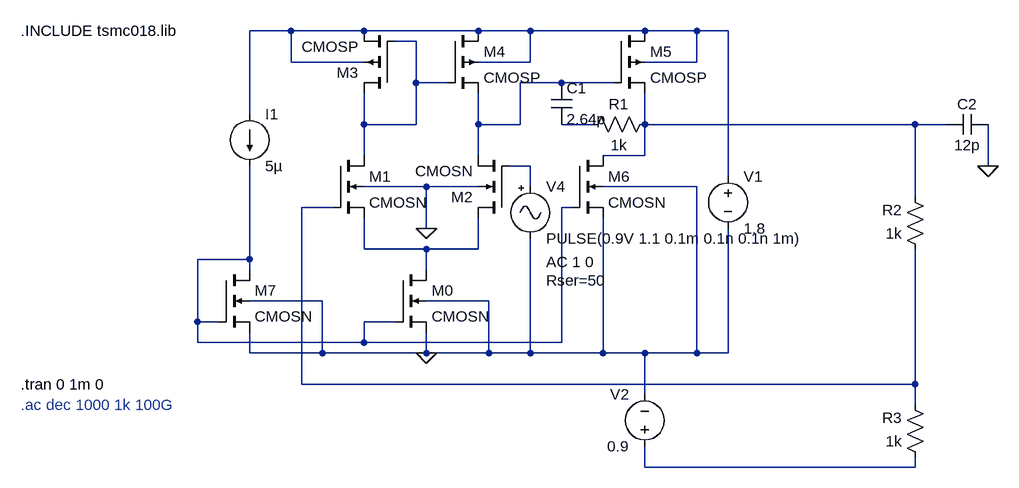
[diagram p0: schematic final_design.asc]
final_design.asc, the LTspice schematic file:
Version 4
SHEET 1 1144 708
WIRE -16 32 -80 32
WIRE 96 32 -16 32
WIRE 272 32 96 32
WIRE 352 32 272 32
WIRE 528 32 352 32
WIRE 608 32 528 32
WIRE 656 32 608 32
WIRE 176 48 144 48
WIRE -16 80 -16 32
WIRE 96 80 -16 80
WIRE 352 80 352 32
WIRE 352 80 272 80
WIRE 608 80 608 32
WIRE 608 80 528 80
WIRE 176 112 176 48
WIRE 224 112 176 112
WIRE 400 112 336 112
WIRE 480 112 400 112
WIRE -80 160 -80 32
WIRE 96 176 96 128
WIRE 176 176 176 112
WIRE 176 176 96 176
WIRE 272 176 272 128
WIRE 336 176 336 112
WIRE 336 176 272 176
WIRE 448 176 400 176
WIRE 528 176 528 128
WIRE 944 176 528 176
WIRE 992 176 944 176
WIRE 96 224 96 176
WIRE 272 224 272 176
WIRE 528 224 528 176
WIRE 528 224 464 224
WIRE 352 240 320 240
WIRE 1056 240 1056 176
WIRE 656 256 656 32
WIRE 192 272 96 272
WIRE 272 272 192 272
WIRE 352 272 352 240
WIRE 608 272 464 272
WIRE 944 288 944 176
WIRE 48 304 0 304
WIRE 416 304 400 304
WIRE 192 336 192 272
WIRE 96 368 96 320
WIRE 192 368 96 368
WIRE 272 368 272 320
WIRE 272 368 192 368
WIRE -80 384 -80 240
WIRE -80 384 -160 384
WIRE -80 400 -80 384
WIRE 192 400 192 368
WIRE 32 448 -80 448
WIRE 288 448 192 448
WIRE -160 480 -160 384
WIRE -128 480 -160 480
WIRE 144 480 96 480
WIRE -160 512 -160 480
WIRE 96 512 96 480
WIRE 96 512 -160 512
WIRE 400 512 400 304
WIRE 400 512 96 512
WIRE -80 528 -80 496
WIRE 32 528 32 448
WIRE 32 528 -80 528
WIRE 192 528 192 496
WIRE 192 528 32 528
WIRE 288 528 288 448
WIRE 288 528 192 528
WIRE 352 528 352 352
WIRE 352 528 288 528
WIRE 464 528 464 320
WIRE 464 528 352 528
WIRE 528 528 464 528
WIRE 608 528 608 272
WIRE 608 528 528 528
WIRE 656 528 656 336
WIRE 656 528 608 528
WIRE 0 576 0 304
WIRE 944 576 944 368
WIRE 944 576 0 576
WIRE 528 592 528 528
WIRE 944 608 944 576
WIRE 528 704 528 672
WIRE 944 704 944 688
WIRE 944 704 528 704
FLAG 192 528 0
FLAG 192 336 0
FLAG 1056 240 0
SYMBOL current -80 160 R0
WINDOW 123 0 0 Left 2
WINDOW 39 0 0 Left 2
SYMATTR InstName I1
SYMATTR Value 5µ
SYMBOL voltage 656 240 R0
WINDOW 123 0 0 Left 2
WINDOW 39 0 0 Left 2
SYMATTR InstName V1
SYMATTR Value 1.8
SYMBOL cmosp 144 128 R180
SYMATTR InstName M3
SYMATTR Value2 l=0.9um w=17.577um
SYMBOL cmosp 224 32 R0
SYMATTR InstName M4
SYMATTR Value2 l=0.9um w=17.577um
SYMBOL cmosn -128 400 R0
SYMATTR InstName M7
SYMATTR Value2 l=0.9um w=0.98um
SYMBOL cmosn 144 400 R0
SYMATTR InstName M0
SYMATTR Value2 l=0.9um w=9.78um
SYMBOL cmosn 48 224 R0
SYMATTR InstName M1
SYMATTR Value2 l=0.9um w=489.132um
SYMBOL cmosn 320 320 R180
SYMATTR InstName M2
SYMATTR Value2 l=0.9um w=489.132um
SYMBOL cmosn 416 224 R0
SYMATTR InstName M6
SYMATTR Value2 l=0.9um w=19.566um
SYMBOL Misc\\signal 352 256 R0
WINDOW 123 24 132 Left 2
WINDOW 39 24 160 Left 2
SYMATTR Value2 AC 1 0
SYMATTR SpiceLine Rser=50
SYMATTR InstName V4
SYMATTR Value PULSE(0.9V 1.1 0.1m 0.1n 0.1n 1m)
SYMBOL cmosp 480 32 R0
SYMATTR InstName M5
SYMATTR Value2 l=0.9u w=285u
SYMBOL cap 384 112 R0
SYMATTR InstName C1
SYMATTR Value 2.64p
SYMBOL cap 1056 160 R90
WINDOW 0 0 32 VBottom 2
WINDOW 3 32 32 VTop 2
SYMATTR InstName C2
SYMATTR Value 12p
SYMBOL res 544 160 R90
WINDOW 0 0 56 VBottom 2
WINDOW 3 32 56 VTop 2
SYMATTR InstName R1
SYMATTR Value 1k
SYMBOL res 960 384 R180
WINDOW 0 36 76 Left 2
WINDOW 3 36 40 Left 2
SYMATTR InstName R2
SYMATTR Value 1k
SYMBOL res 960 704 R180
WINDOW 0 36 76 Left 2
WINDOW 3 36 40 Left 2
SYMATTR InstName R3
SYMATTR Value 1k
SYMBOL voltage 528 688 R180
WINDOW 0 24 96 Left 2
WINDOW 3 24 16 Left 2
WINDOW 123 0 0 Left 0
WINDOW 39 0 0 Left 0
SYMATTR InstName V2
SYMATTR Value 0.9
TEXT -432 32 Left 2 !.INCLUDE tsmc018.lib
TEXT -432 608 Left 2 ;.ac dec 1000 1k 100G
TEXT -432 576 Left 2 !.tran 0 1m 0

The netlist it stands for:
* final_design.asc
I1 N001 N008 5µ
V1 N001 0 1.8
M3 N002 N002 N001 N001 CMOSP l=0.9um w=17.577um
M4 N001 N002 N003 N001 CMOSP l=0.9um w=17.577um
M7 N008 N008 0 0 CMOSN l=0.9um w=0.98um
M0 N009 N008 0 0 CMOSN l=0.9um w=9.78um
M1 N002 N007 N009 0 CMOSN l=0.9um w=489.132um
M2 N009 N006 N003 0 CMOSN l=0.9um w=489.132um
M6 N005 N008 0 0 CMOSN l=0.9um w=19.566um
V4 N006 0 PULSE(0.9V 1.1 0.1m 0.1n 0.1n 1m) AC 1 0 Rser=50
M5 N001 N003 N005 N001 CMOSP l=0.9u w=285u
C1 N003 N004 2.64p
C2 0 N005 12p
R1 N005 N004 1k
R2 N007 N005 1k
R3 N010 N007 1k
V2 N010 0 0.9
.model NMOS NMOS
.model PMOS PMOS
.lib standard.mos
.INCLUDE tsmc018.lib
* .ac dec 1000 1k 100G
.tran 0 1m 0
.backanno
.end